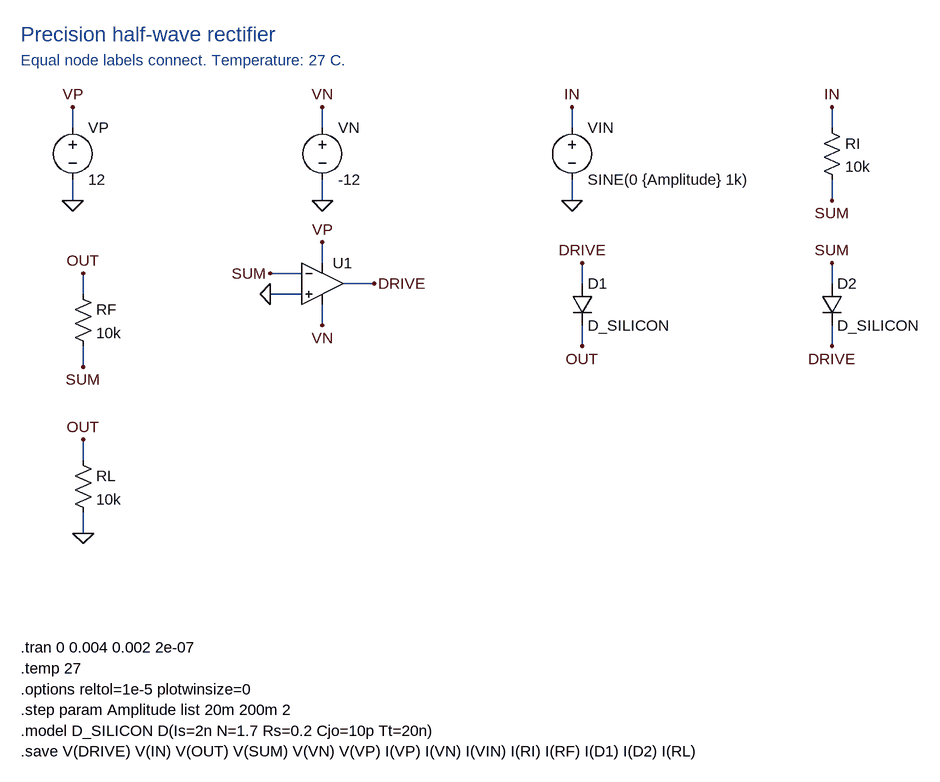
[diagram p0: schematic precision-rectifier.asc]
precision-rectifier.asc, the LTspice schematic file:
Version 4
SHEET 1 1740 1288
WIRE 144 176 144 144
WIRE 144 256 144 288
WIRE 528 176 528 144
WIRE 528 256 528 288
WIRE 912 176 912 144
WIRE 912 256 912 288
WIRE 1312 176 1312 144
WIRE 1312 256 1312 288
WIRE 160 432 160 400
WIRE 160 512 160 544
WIRE 496 432 448 432
WIRE 496 400 448 400
WIRE 528 384 528 352
WIRE 528 448 528 480
WIRE 560 416 608 416
WIRE 928 416 928 384
WIRE 928 480 928 512
WIRE 1312 416 1312 384
WIRE 1312 480 1312 512
WIRE 160 688 160 656
WIRE 160 768 160 800
FLAG 144 144 VP
FLAG 144 288 0
FLAG 528 144 VN
FLAG 528 288 0
FLAG 912 144 IN
FLAG 912 288 0
FLAG 1312 144 IN
FLAG 1312 288 SUM
FLAG 160 400 OUT
FLAG 160 544 SUM
FLAG 448 432 0
FLAG 448 400 SUM
FLAG 528 352 VP
FLAG 528 480 VN
FLAG 608 416 DRIVE
FLAG 928 384 DRIVE
FLAG 928 512 OUT
FLAG 1312 384 SUM
FLAG 1312 512 DRIVE
FLAG 160 656 OUT
FLAG 160 800 0
SYMBOL voltage 144 160 R0
SYMATTR InstName VP
SYMATTR Value 12
SYMBOL voltage 528 160 R0
SYMATTR InstName VN
SYMATTR Value -12
SYMBOL voltage 912 160 R0
SYMATTR InstName VIN
SYMATTR Value SINE(0 {Amplitude} 1k)
SYMBOL res 1296 160 R0
SYMATTR InstName RI
SYMATTR Value 10k
SYMBOL res 144 416 R0
SYMATTR InstName RF
SYMATTR Value 10k
SYMBOL OpAmps/UniversalOpamp2 528 416 R0
SYMATTR InstName U1
SYMATTR SpiceModel level2
SYMATTR Value2 Avol=1Meg GBW=10Meg Slew=10Meg
SYMATTR SpiceLine Ilimit=100m Rail=0.5 Vos=0
SYMATTR SpiceLine2 En=0 Enk=0 In=0 Ink=0 Rin=1G
SYMBOL diode 912 416 R0
SYMATTR InstName D1
SYMATTR Value D_SILICON
SYMBOL diode 1296 416 R0
SYMATTR InstName D2
SYMATTR Value D_SILICON
SYMBOL res 144 672 R0
SYMATTR InstName RL
SYMATTR Value 10k
TEXT 64 32 Left 3 ;Precision half-wave rectifier
TEXT 64 72 Left 2 ;Equal node labels connect. Temperature: 27 C.
TEXT 64 976 Left 2 !.tran 0 0.004 0.002 2e-07
TEXT 64 1008 Left 2 !.temp 27
TEXT 64 1040 Left 2 !.options reltol=1e-5 plotwinsize=0
TEXT 64 1072 Left 2 !.step param Amplitude list 20m 200m 2
TEXT 64 1104 Left 2 !.model D_SILICON D(Is=2n N=1.7 Rs=0.2 Cjo=10p Tt=20n)
TEXT 64 1136 Left 2 !.save V(DRIVE) V(IN) V(OUT) V(SUM) V(VN) V(VP) I(VP) I(VN) I(VIN) I(RI) I(RF) I(D1) I(D2) I(RL)

The netlist it stands for:
* precision-rectifier.asc
VP VP 0 12
VN VN 0 -12
VIN IN 0 SINE(0 {Amplitude} 1k)
RI IN SUM 10k
RF OUT SUM 10k
XU1 0 SUM VP VN DRIVE level2 Avol=1Meg GBW=10Meg Slew=10Meg Ilimit=100m Rail=0.5 Vos=0 En=0 Enk=0 In=0 Ink=0 Rin=1G  ; pins In+ In- V+ V- OUT
D1 DRIVE OUT D_SILICON
D2 SUM DRIVE D_SILICON
RL OUT 0 10k
.model D D
.lib standard.dio
* Precision half-wave rectifier
* Equal node labels connect. Temperature: 27 C.
.tran 0 0.004 0.002 2e-07
.temp 27
.options reltol=1e-5 plotwinsize=0
.step param Amplitude list 20m 200m 2
.model D_SILICON D(Is=2n N=1.7 Rs=0.2 Cjo=10p Tt=20n)
.save V(DRIVE) V(IN) V(OUT) V(SUM) V(VN) V(VP) I(VP) I(VN) I(VIN) I(RI) I(RF) I(D1) I(D2) I(RL)
.lib UniversalOpAmp2.lib
.backanno
.end